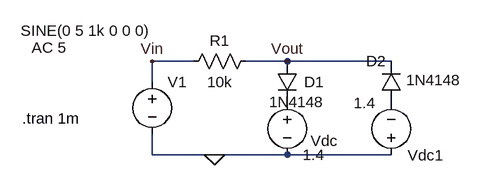
[diagram p0: schematic 9f.asc]
9f.asc, the LTspice schematic file:
Version 4
SHEET 1 880 680
WIRE 128 64 64 64
WIRE 272 64 208 64
WIRE 432 64 272 64
WIRE 64 96 64 64
WIRE 64 208 64 176
WIRE 160 208 64 208
WIRE 272 208 160 208
WIRE 432 208 272 208
FLAG 160 208 0
FLAG 272 64 Vout
FLAG 64 64 Vin
SYMBOL voltage 64 80 R0
WINDOW 123 -185 -37 Left 2
WINDOW 39 0 0 Left 0
WINDOW 3 -202 -63 Left 2
SYMATTR Value2 AC 5
SYMATTR Value SINE(0 5 1k 0 0 0)
SYMATTR InstName V1
SYMBOL voltage 272 112 R0
WINDOW 123 0 0 Left 0
WINDOW 39 0 0 Left 0
WINDOW 0 36 75 Left 2
SYMATTR InstName Vdc
SYMATTR Value 1.4
SYMBOL res 224 48 R90
WINDOW 0 0 56 VBottom 2
WINDOW 3 32 56 VTop 2
SYMATTR InstName R1
SYMATTR Value 10k
SYMBOL diode 256 64 R0
WINDOW 0 42 32 Left 2
WINDOW 3 -12 63 Left 2
SYMATTR InstName D1
SYMATTR Value 1N4148
SYMBOL diode 448 128 R180
WINDOW 0 24 64 Left 2
WINDOW 3 -92 35 Left 2
SYMATTR InstName D2
SYMATTR Value 1N4148
SYMBOL voltage 432 224 R180
WINDOW 123 0 0 Left 0
WINDOW 39 0 0 Left 0
WINDOW 0 -80 15 Left 2
SYMATTR InstName Vdc1
SYMATTR Value 1.4
TEXT -136 152 Left 2 !.tran 1m

The netlist it stands for:
* 9f.asc
V1 Vin 0 SINE(0 5 1k 0 0 0) AC 5
Vdc P001 0 1.4
R1 Vout Vin 10k
D1 Vout P001 1N4148
D2 P002 Vout 1N4148
Vdc1 0 P002 1.4
.model D D
.lib standard.dio
.tran 1m
.backanno
.end